# Altium schematic sheet IMU.SchDoc
size B; SheetNumber: 6; SheetTotal: 9
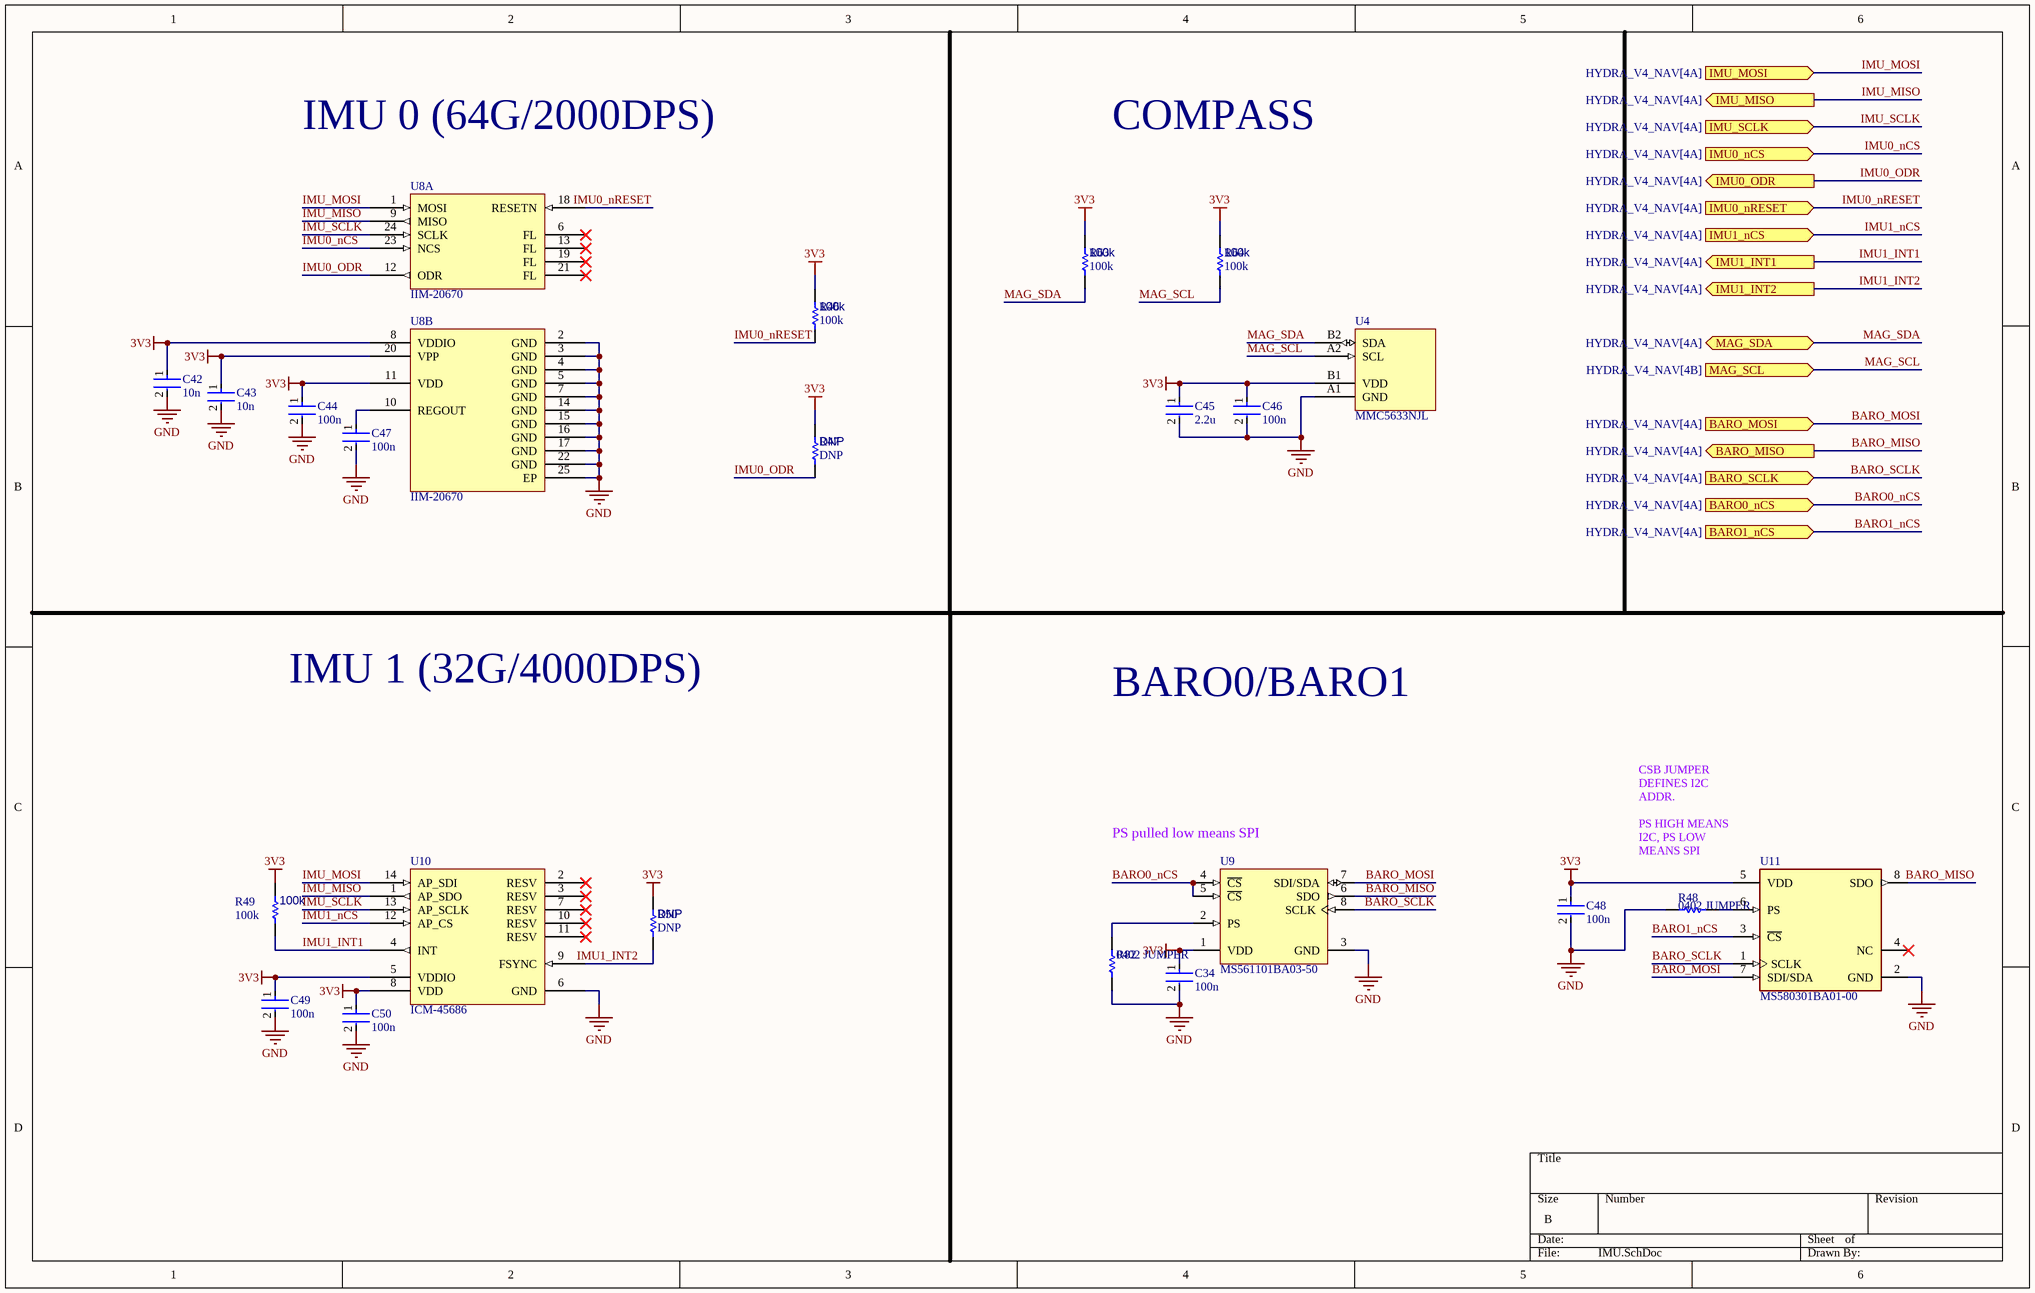
[diagram p0: IMU.SchDoc]

## Parts
C34  100n  [FP-0402-L_1_0_0_05-W_0_5-IPC_A]
C42  10n  [FP-0402-L_1_0_0_05-W_0_5-IPC_A]
C43  10n  [FP-0402-L_1_0_0_05-W_0_5-IPC_A]
C44  100n  [FP-0402-L_1_0_0_05-W_0_5-IPC_A]
C45  2.2u  [FP-0402-L_1_0_0_05-W_0_5-IPC_A]
C46  100n  [FP-0402-L_1_0_0_05-W_0_5-IPC_A]
C47  100n  [FP-0402-L_1_0_0_05-W_0_5-IPC_A]
C48  100n  [FP-0402-L_1_0_0_05-W_0_5-IPC_A]
C49  100n  [FP-0402-L_1_0_0_05-W_0_5-IPC_A]
C50  100n  [FP-0402-L_1_0_0_05-W_0_5-IPC_A]
R46  100k  [R0603B]
R47  DNP  [R0603B]
R48  0402 JUMPER  [RESC1005X40X25ML05T05]
R49  100k  [R0603B]
R50  DNP  [R0603B]
R63  100k  [R0603B]
R64  100k  [R0603B]
R82  0402 JUMPER  [RESC1005X40X25ML05T05]
U4  MMC5633NJL  [BGA4C40P2X2_85X85X60]
U8  IIM-20670  [PQFN50P450X450X115_HS-25N]  (parts A,B of 2)
U9  MS561101BA03-50  [MSI-MS561101BA03-50-8_V]
U10  ICM-45686  [PQFN50P300X250X86-14N]
U11  MS580301BA01-00  [FP-MS580301BA01-00-MFG]

## Ports
BARO0_nCS (in, see HYDRA_V4_NAV[4A]), BARO1_nCS (in, see HYDRA_V4_NAV[4A]), BARO_MISO (out, see HYDRA_V4_NAV[4A]), BARO_MOSI (in, see HYDRA_V4_NAV[4A]), BARO_SCLK (in, see HYDRA_V4_NAV[4A]), IMU0_nCS (in, see HYDRA_V4_NAV[4A]), IMU0_nRESET (in, see HYDRA_V4_NAV[4A]), IMU0_ODR (out, see HYDRA_V4_NAV[4A]), IMU1_INT1 (out, see HYDRA_V4_NAV[4A]), IMU1_INT2 (out, see HYDRA_V4_NAV[4A]), IMU1_nCS (in, see HYDRA_V4_NAV[4A]), IMU_MISO (out, see HYDRA_V4_NAV[4A]), IMU_MOSI (in, see HYDRA_V4_NAV[4A]), IMU_SCLK (in, see HYDRA_V4_NAV[4A]), MAG_SCL (in, see HYDRA_V4_NAV[4B]), MAG_SDA (bidir, see HYDRA_V4_NAV[4A])

## Nets
3V3: C34.1 C42.1 C43.1 C44.1 C45.1 C46.1 C48.1 C49.1 C50.1 R46.1 R47.1 R49.1 R50.1 R63.1 R64.1 U4.B1(VDD) U8.8(VDDIO) U8.11(VDD) U8.20(VPP) U9.1(VDD) U10.5(VDDIO) U10.8(VDD) U11.5(VDD)
GND: C34.2 C42.2 C43.2 C44.2 C45.2 C46.2 C47.2 C48.2 C49.2 C50.2 R48.2 R82.1 U4.A1(GND) U8.2(GND) U8.3(GND) U8.4(GND) U8.5(GND) U8.7(GND) U8.14(GND) U8.15(GND) U8.16(GND) U8.17(GND) U8.22(GND) U8.25(EP) U9.3(GND) U10.6(GND) U11.2(GND)
BARO0_nCS: U9.4(~{CS}) U9.5(~{CS}) ; port BARO0_nCS
BARO1_nCS: U11.3(~{CS}) ; port BARO1_nCS
BARO_MISO: U9.6(SDO) U11.8(SDO) ; port BARO_MISO
BARO_MOSI: U9.7(SDI/SDA) U11.7(SDI/SDA) ; port BARO_MOSI
BARO_SCLK: U9.8(SCLK) U11.1(SCLK) ; port BARO_SCLK
IMU0_nCS: U8.23(NCS) ; port IMU0_nCS
IMU0_nRESET: R46.2 U8.18(RESETN) ; port IMU0_nRESET
IMU0_ODR: R47.2 U8.12(ODR) ; port IMU0_ODR
IMU1_INT1: R49.2 U10.4(INT) ; port IMU1_INT1
IMU1_INT2: R50.2 U10.9(FSYNC) ; port IMU1_INT2
IMU1_nCS: U10.12(AP_CS) ; port IMU1_nCS
IMU_MISO: U8.9(MISO) U10.1(AP_SDO) ; port IMU_MISO
IMU_MOSI: U8.1(MOSI) U10.14(AP_SDI) ; port IMU_MOSI
IMU_SCLK: U8.24(SCLK) U10.13(AP_SCLK) ; port IMU_SCLK
MAG_SCL: R64.2 U4.A2(SCL) ; port MAG_SCL
MAG_SDA: R63.2 U4.B2(SDA) ; port MAG_SDA
NetC47_1: C47.1 U8.10(REGOUT)
NetR48_1: R48.1 U11.6(PS)
NetR82_2: R82.2 U9.2(PS)

Not connected (* = marked no-connect by the designer): U8 6(FL)* 13(FL)* 19(FL)* 21(FL)*; U10 2(RESV)* 3(RESV)* 7(RESV)* 10(RESV)* 11(RESV)*; U11 4(NC)*

## Notes on the sheet
- IMU 0 (64G/2000DPS)
- COMPASS
- IMU 1 (32G/4000DPS)
- BARO0/BARO1
- (near U9) PS pulled low means SPI
- (near U11) CSB JUMPER DEFINES I2C ADDR.
  PS HIGH MEANS I2C, PS LOW MEANS SPI

## Library data of the parts
C34 C42-C50 = CMP-001-00058-1: LARGE PADS, 0402 CAP, CHANGE COMMENT TO MATCH REAL P/N; Capacitor Type: Ceramic; Min Operating Temperature: -55°C; Mounting Technology: Surface Mount; Pins: 2; Case/Package: 0402; RoHS Compliant: Yes; Max Operating Temperature: 85°C
  C34 C44 C46-C50: Value: 100n
  C42 C43: Value: 10n
  C45: Value: 2.2u
R46 R47 R49 R50 R63 R64 = CMP-009-00002-14: Resistor
  R46 R49 R63 R64: Value: 100k
  R47 R50: Value: DNP
R48 R82 = CMP-009-00118-2: READ THE NAME; Pins: 2; Component Type: Standard; Design Item ID: CMP-009-00206-2; Source: 0402jump.SchLib; Value: 0402 JUMPER
U4 = CMP-010-00014-2: Magnetoresistive Sensor X, Y, Z Axis 4-WLP (0.85x0.85)
U8 = CMP-010-00029-4: 6-axis IMU with extended temperature range and high VRE performance
U9 = CMP-2000-05251-1: Barometric Pressure Sensor, with Stainless Steel Cap, 1.8 to 3.6 V, -45 to 85 degC, 8-Pin QFN, RoHS, Tape and Reel; Manufacturer: Measurement Specialties; Operating Pressure Max: 1200mbar; Supply Current: 12.5µA; Supply Voltage Max: 3.6V; Supply Voltage Min: 1.8V; No. of Pins: 8; Connection Size: 0.5mm; SVHC: NoSVHC(20-Jun-2013); Operating Pressure Min: 10mbar; Manufacturer URL: http://www.meas-spec.com/; Operating Temperature Min: -40degC; Pressure Type: Barometric; Package Reference: MS561101BA03-50-8; Datasheet URL: http://www.te.com/commerce/DocumentDelivery/DDEController?Action=srchrtrv&DocNm=MS5611-01BA03&DocType=Data+Sheet&DocLang=English&DocFormat=pdf&PartCntxt=CAT-BLPS0036; Package Description: 8-Pin Surface Mount Device, Body 5 x 3 mm, Pitch 1.25 mm; Sensor Case Style: QFN; Datasheet Version: Sep-15; Operating Temperature Max: 85degC
U10 = CMP-010-00035-1: Ultra High-Performance 6-Axis MEMS Motion Sensor
U11 = CMP-03338-000001-1: MINIATURE ALTIMETER MODULE; Manufacturer: TE Connectivity; Port Style: No Port; Min Supply Voltage: 1.8V; Response Time: 8.22ms; Sensor Output: I2C,SPI; Max Supply Voltage: 3.6V; Standoff Height: 0.1mm; Operating Supply Current: 0.9-12.5uA; Manufacturer Part Number: MS580301BA01-00; Device Class L1: Sensors; Mouser Description: MS5803-01BA Series 3 V 1 to 130 kPa Miniature Variometer Module; Temperature Range High: +85°C; Temperature: -40°C to +85°C; Category: IC; Device Class L3: unset; Device Class L2: Pressure Sensors; RoHS: TRUE; ComponentLink2Description: Datasheet; Automotive: No; Temperature Range Low: -40°C; Package: 0; Lead Free: Yes; Octopart: https://octopart.com/ms580301ba01-00-te+connectivity-59208927; Height: 3.33mm; Digikey Description: MINIATURE ALTIMETER MODULE; ComponentLink2URL: https://www.te.com/commerce/DocumentDelivery/DDEController?Action=showdoc&DocId=Data+Sheet%7FMS5803-01BA%7FB3%7Fpdf%7FEnglish%7FENG_DS_MS5803-01BA_B3.pdf%7FMS580301BA01-00